# Altium schematic sheet MCU.SchDoc
size A
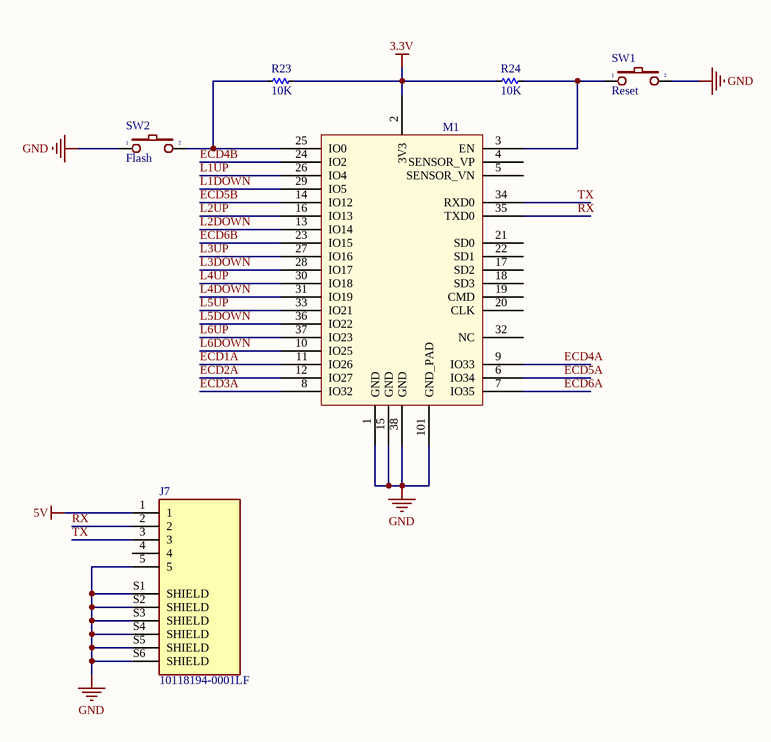
[diagram p0: MCU.SchDoc]

## Parts
J7  10118194-0001LF  [AMPHENOL_10118194-0001LF]
M1  ESP32S_Module  [ESP32S]  (value not drawn)
R23  10K  [RES-SMD-0805]
R24  10K  [RES-SMD-0805]
SW1  Reset  [SW1-SMD]
SW2  Flash  [SW-DIP1-1]

## Nets
3.3V: M1.2(3V3) R23.1 R24.2
5V: J7.1
GND: J7.5 J7.S1(SHIELD) J7.S2(SHIELD) J7.S3(SHIELD) J7.S4(SHIELD) J7.S5(SHIELD) J7.S6(SHIELD) M1.1(GND) M1.15(GND) M1.38(GND) M1.101(GND_PAD) SW1.2 SW2.1
ECD1A: M1.11(IO26)
ECD2A: M1.12(IO27)
ECD3A: M1.8(IO32)
ECD4A: M1.9(IO33)
ECD4B: M1.24(IO2)
ECD5A: M1.6(IO34)
ECD5B: M1.14(IO12)
ECD6A: M1.7(IO35)
ECD6B: M1.23(IO15)
L1DOWN: M1.29(IO5)
L1UP: M1.26(IO4)
L2DOWN: M1.13(IO14)
L2UP: M1.16(IO13)
L3DOWN: M1.28(IO17)
L3UP: M1.27(IO16)
L4DOWN: M1.31(IO19)
L4UP: M1.30(IO18)
L5DOWN: M1.36(IO22)
L5UP: M1.33(IO21)
L6DOWN: M1.10(IO25)
L6UP: M1.37(IO23)
RX: J7.2 M1.35(TXD0)
TX: J7.3 M1.34(RXD0)
NetM1_3: M1.3(EN) R24.1 SW1.1
NetM1_25: M1.25(IO0) R23.2 SW2.2

Not connected (* = marked no-connect by the designer): J7 4; M1 4(SENSOR_VP) 5(SENSOR_VN) 17(SD2) 18(SD3) 19(CMD) 20(CLK) 21(SD0) 22(SD1) 32(NC)

## Library data of the parts
J7 = 10118194-0001LF: USB - micro B USB 2.0 Receptacle Connector 5 Position Surface Mount, Right Angle; Through Hole; MF: Amphenol ICC; Package: None; Price: None; Availability: Unavailable; MP: 10118194-0001LF; SnapEDA_Link: https://www.snapeda.com/parts/10118194-0001LF/Amphenol%20FCI/view-part/1413308/?ref=snap; Value: *
M1 = ESP32S_Module: Esp-32S; Datasheet: https://espressif.com/sites/default/files/documentation/esp_wroom_32_datasheet_en.pdf
R23 R24 = Res-SMD: Resistor; Manufacturer: Generic Components; Class: Passive; Published: 08/06/2000; Publisher: Altium Hobart Technology Centre
SW1 SW2 = SW2: Switch button 2 pin; Value: SW chip 2 pin